# EAGLE design SOC_1_0 (EAGLE 8.3.2)
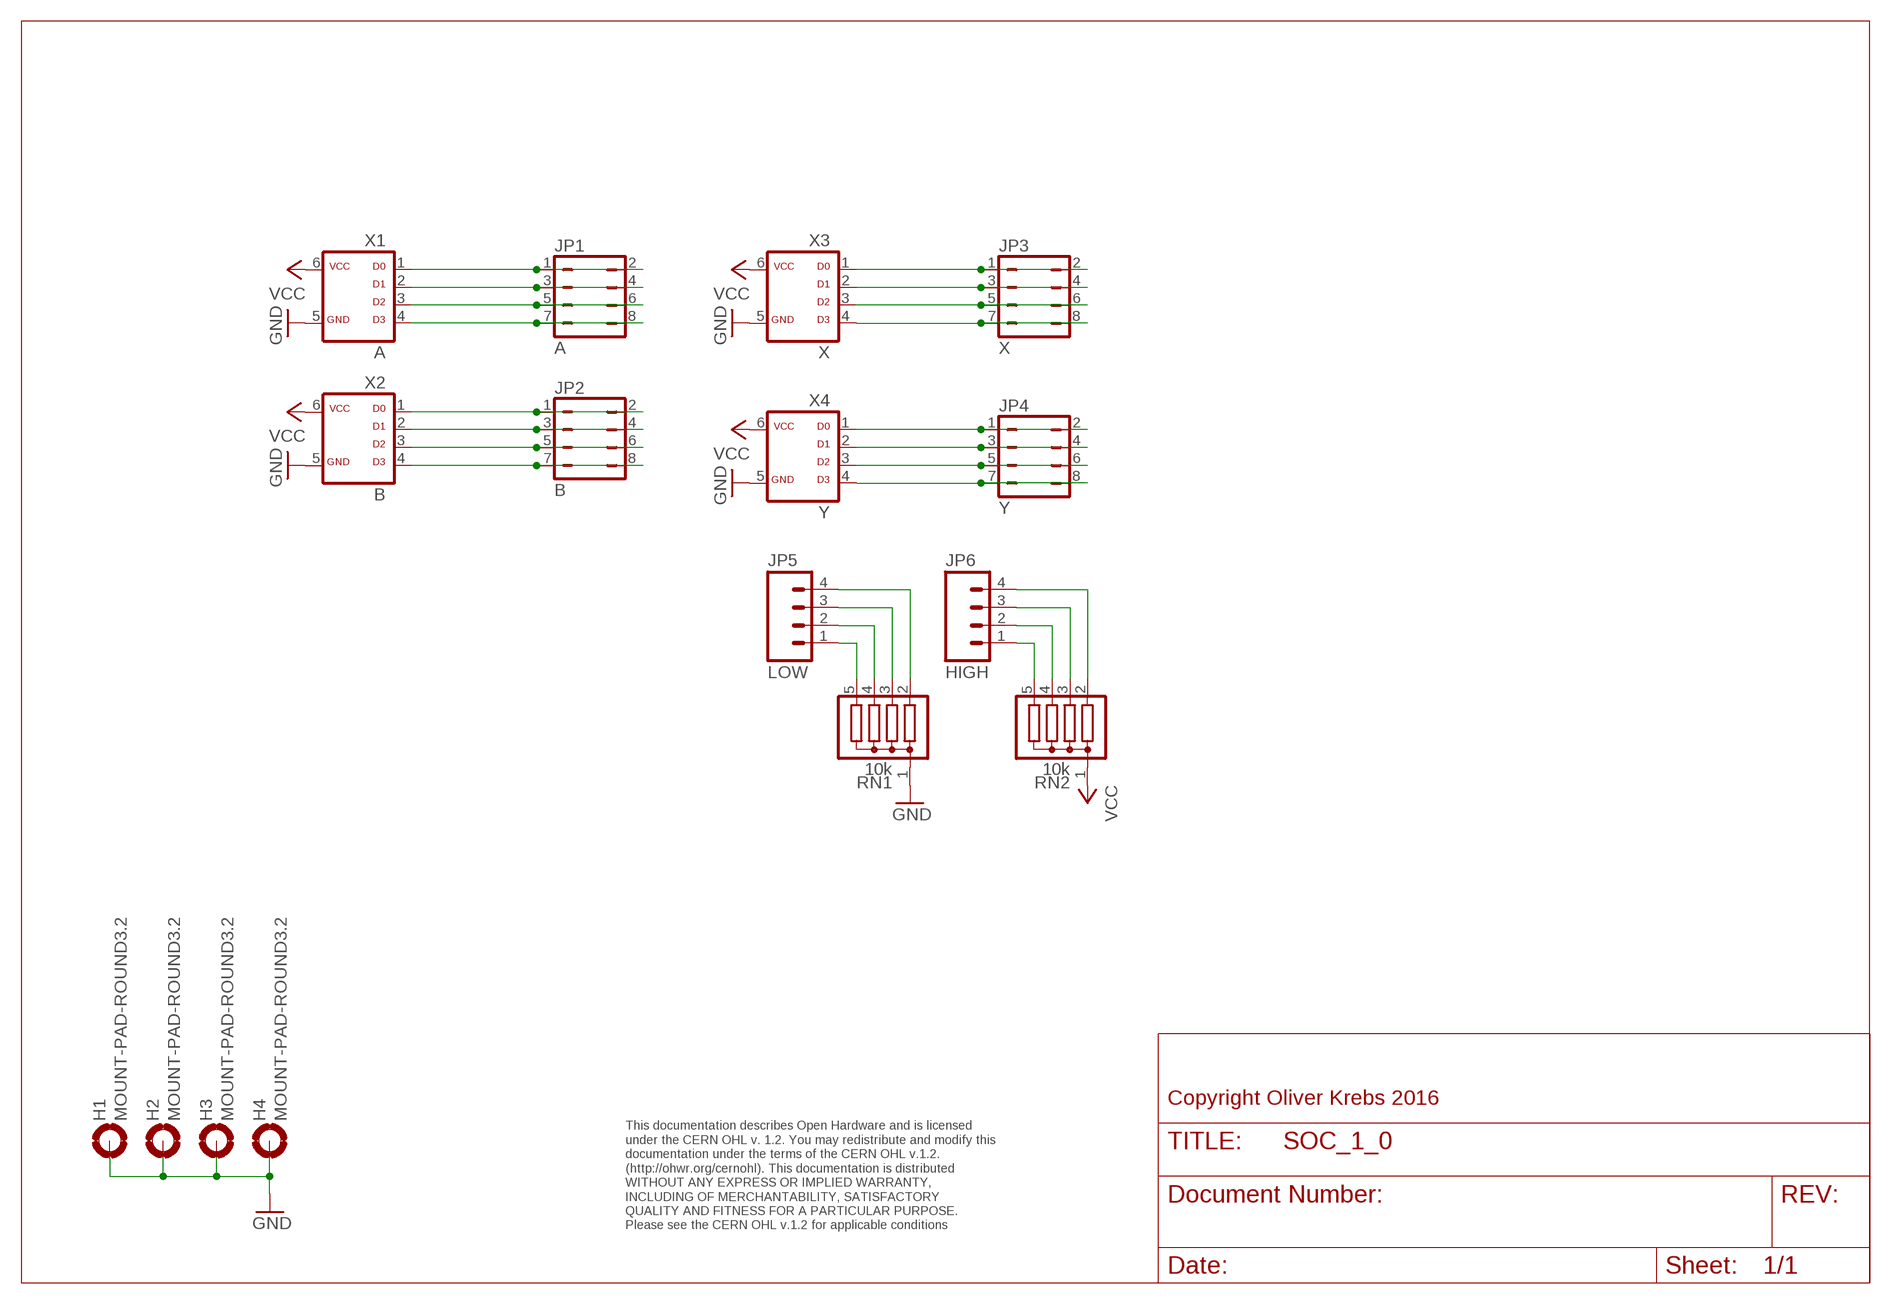
[diagram p0: schematic, sheet 1]

## Parts
H1  MOUNT-PAD-ROUND3.2  [3,2-PAD]
H2  MOUNT-PAD-ROUND3.2  [3,2-PAD]
H3  MOUNT-PAD-ROUND3.2  [3,2-PAD]
H4  MOUNT-PAD-ROUND3.2  [3,2-PAD]
JP1  A  JP4Q  [JP4Q]
JP2  B  JP4Q  [JP4Q]
JP3  X  JP4Q  [JP4Q]
JP4  Y  JP4Q  [JP4Q]
JP5  LOW  M04PTH  [1X04]
JP6  HIGH  M04PTH  [1X04]
RN1  10k  G04R  [SIL5]
RN2  10k  G04R  [SIL5]
X1  A  ML6D  [ML-6]
X2  B  ML6D  [ML-6]
X3  X  ML6D  [ML-6]
X4  Y  ML6D  [ML-6]

## Nets
GND: H1.B3,2(MOUNT) H2.B3,2(MOUNT) H3.B3,2(MOUNT) H4.B3,2(MOUNT) RN1.1 X1.5 X2.5 X3.5 X4.5
N$1: JP2.1 JP2.2 X2.1
N$2: JP2.3 JP2.4 X2.2
N$3: JP2.5 JP2.6 X2.3
N$4: JP2.7 JP2.8 X2.4
N$5: JP4.1 JP4.2 X4.1
N$6: JP4.3 JP4.4 X4.2
N$7: JP4.5 JP4.6 X4.3
N$8: JP4.7 JP4.8 X4.4
N$9: JP1.1 JP1.2 X1.1
N$10: JP1.3 JP1.4 X1.2
N$11: JP1.5 JP1.6 X1.3
N$12: JP1.7 JP1.8 X1.4
N$13: JP3.1 JP3.2 X3.1
N$14: JP3.3 JP3.4 X3.2
N$15: JP3.5 JP3.6 X3.3
N$16: JP3.7 JP3.8 X3.4
N$17: JP5.2 RN1.4
N$18: JP5.3 RN1.3
N$19: JP5.1 RN1.5
N$22: JP5.4 RN1.2
N$23: JP6.1 RN2.5
N$24: JP6.2 RN2.4
N$25: JP6.3 RN2.3
N$26: JP6.4 RN2.2
VCC: RN2.1 X1.6 X2.6 X3.6 X4.6

## Notes on the sheet
- Copyright Oliver Krebs 2016
- This documentation describes Open Hardware and is licensed 
  under the CERN OHL v. 1.2. You may redistribute and modify this 
  documentation under the terms of the CERN OHL v.1.2. 
  (http://ohwr.org/cernohl). This documentation is distributed
  WITHOUT ANY EXPRESS OR IMPLIED WARRANTY, 
  INCLUDING OF MERCHANTABILITY, SATISFACTORY 
  QUALITY AND FITNESS FOR A PARTICULAR PURPOSE. 
  Please see the CERN OHL v.1.2 for applicable conditions

## Library data of the parts
H1-H4 = holes:MOUNT-PAD-ROUND: MOUNTING PAD, round
JP1-JP4 = 01-my-jumper:JP4Q: JUMPER
JP5 JP6 = SparkFun-Connectors:M04: Header 4 Standard 4-pin 0.1" header. Use with straight break away headers (SKU : PRT-00116), right angle break away headers (PRT-00553), swiss pins (PRT-00743), machine pins (PRT-00117), and female headers (PRT-00115). Molex polarized connector foot print use with SKU : PRT-08231 with associated crimp pins and housings. 1MM SMD Version SKU: PRT-10208
RN1 RN2 = resistor-sil:G04R: SIL RESISTOR; OC_FARNELL: unknown; OC_NEWARK: unknown
X1-X4 = 01-my-con:ML6D

## Board
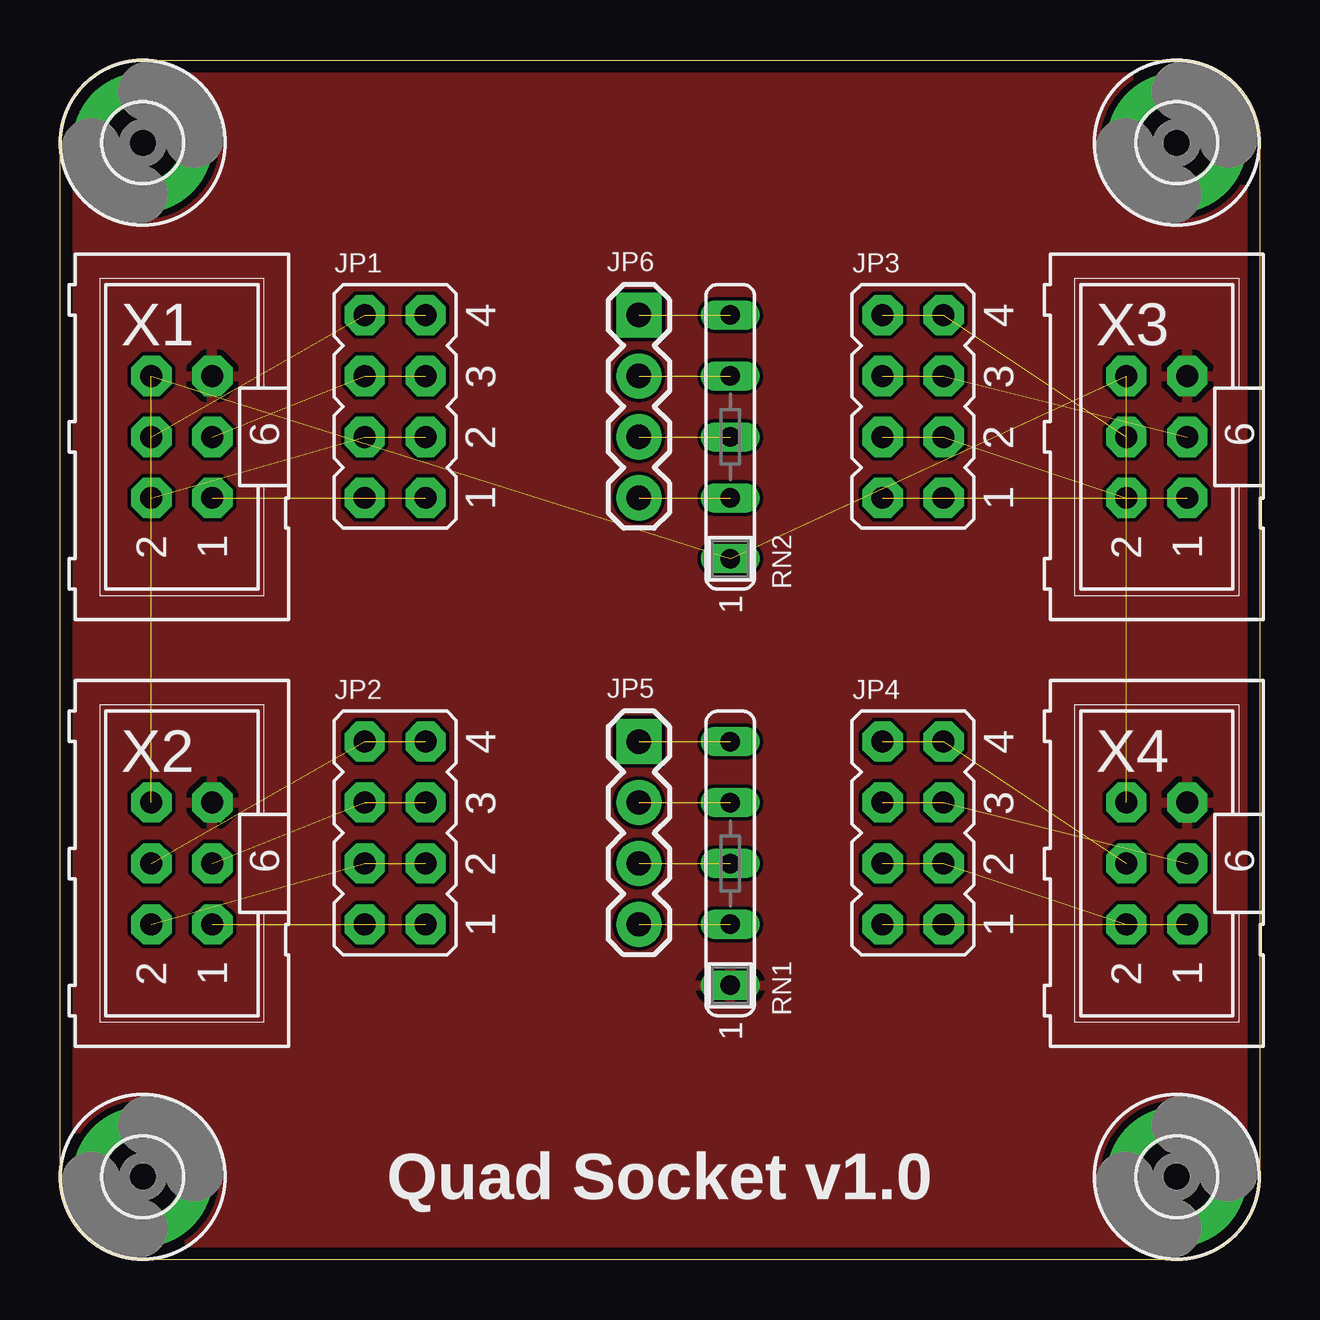
[diagram p1: board, top side]
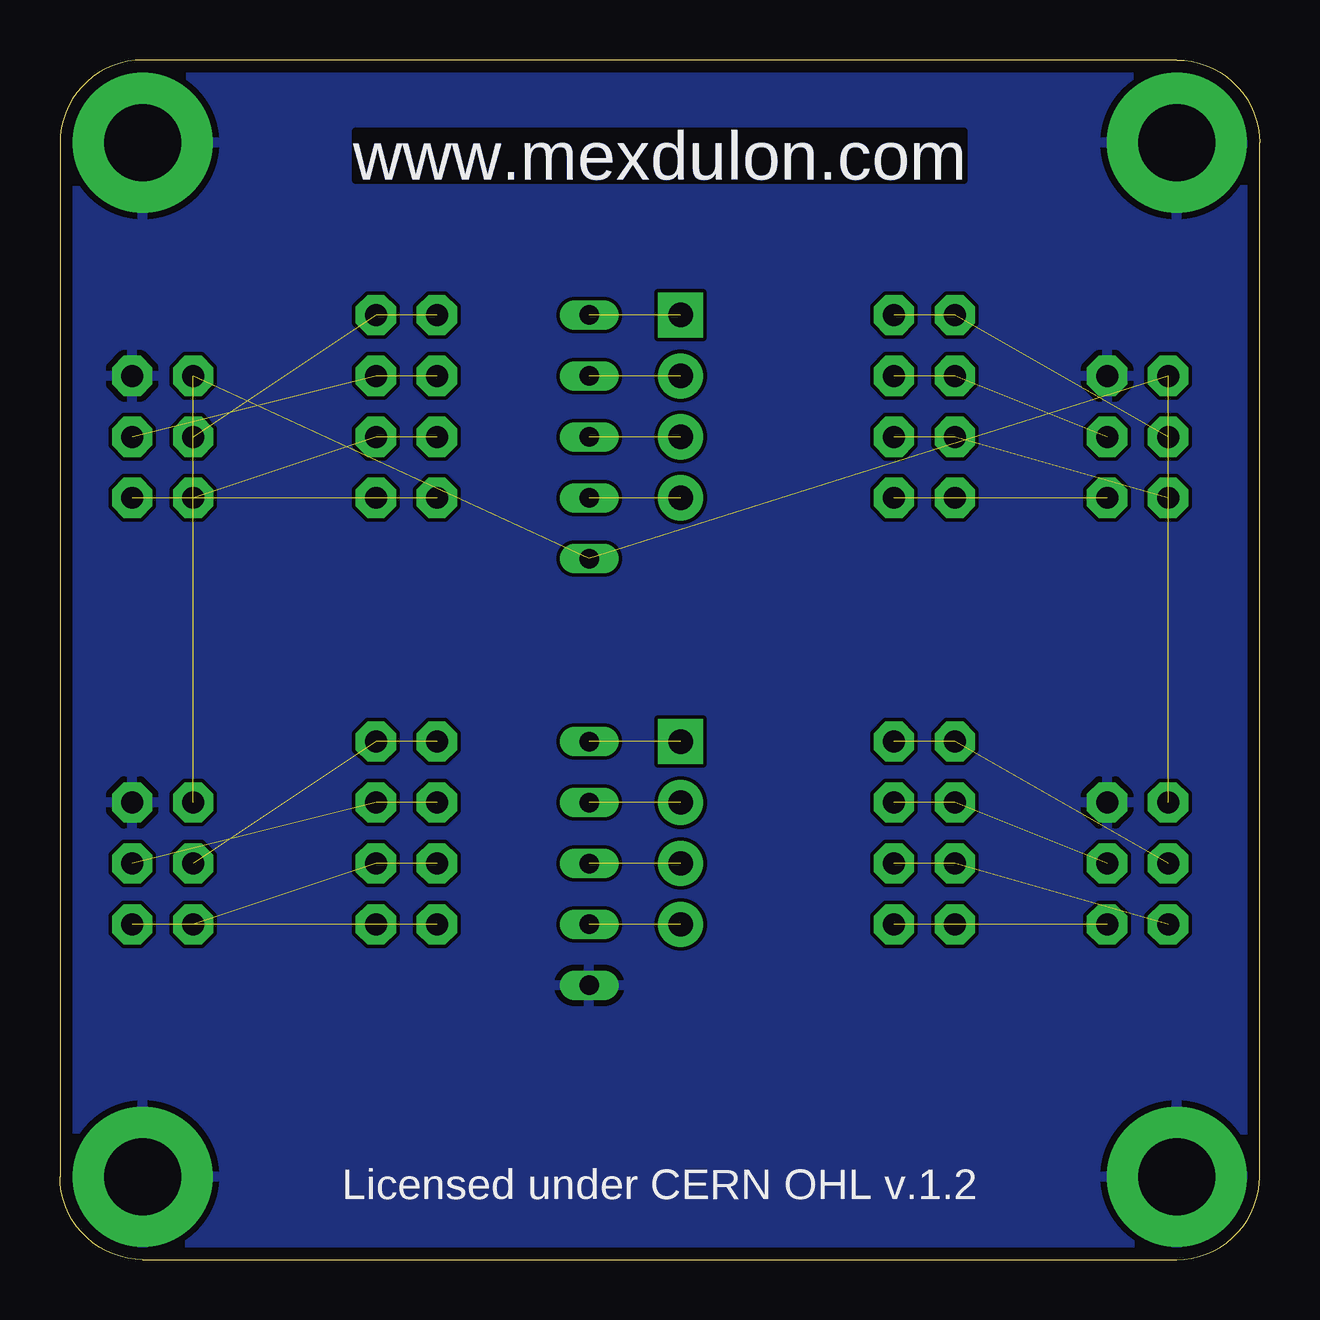
[diagram p2: board, bottom side, seen from below]

Size 50 x 50 mm. Coordinates in mm from the lower left corner, seen from the top.
Outline: 0,3.45 0,46.55 arc-90 3.45,50 46.55,50 arc-90 50,46.55 50,3.45 arc-90 46.55,0 3.45,0 arc-90 0,3.45
Copper layers (1*16): Top 0.035mm / dielectric 1.6mm / Bottom 0.035mm
Design rules "Elecrow_2-layer_PCB_eagle_rule": minimum track width 6mil, minimum drill 12mil, track to track 6mil, track to pad 6mil, pad to pad 6mil, via to via 8mil, smd to smd 0mil, copper to edge 20mil, drill to drill 10mil, minimum pad ring 6mil, minimum via ring 6mil, stop-mask expansion 0mil, vias tented up to drill 100mil, thermal gap 10mil

### Footprints (pad centres in the part's own frame; a part is rotated, then mirrored left to right if it is on the bottom)
3,2-PAD = drill 3.2 pad 5.842: B3,2 0,0
JP4Q = drill 0.914 pad 1.676 octagon: 1 -3.81,-1.27; 2 -3.81,1.27; 3 -1.27,-1.27; 4 -1.27,1.27; 5 1.27,-1.27; 6 1.27,1.27; 7 3.81,-1.27; 8 3.81,1.27
1X04 = drill 1.016 pad 1.88 square: 1 0,0 | drill 1.016 pad 1.88: 2 2.54,0; 3 5.08,0; 4 7.62,0
SIL5 = drill 0.813 long: 1 -5.08,0; 2 -2.54,0; 3 0,0; 4 2.54,0; 5 5.08,0
ML-6 = drill 0.914 pad 1.676 octagon: 1 -2.54,-1.27; 2 -2.54,1.27; 3 0,-1.27; 4 0,1.27; 5 2.54,-1.27; 6 2.54,1.27

### Placement (x,y rotation side)
H1  3.45,3.45 0 top
H2  3.45,46.55 0 top
H3  46.55,3.45 0 top
H4  46.55,46.55 0 top
JP1  13.97,35.56 90 top
JP2  13.97,17.78 90 top
JP3  35.56,35.56 90 top
JP4  35.56,17.78 90 top
JP5  24.13,21.59 270 top
JP6  24.13,39.37 270 top
RN1  27.94,16.51 90 top
RN2  27.94,34.29 90 top
X1  5.08,34.29 90 top
X2  5.08,16.51 90 top
X3  45.72,34.29 90 top
X4  45.72,16.51 90 top

### Tracks (layer width: path | path; a pad name or v marks a point on that pad's centre or on a via)
GND
  pour Bottom: 0,0 50.8,0 50.8,50.8 0,50.8
  pour Top: 0,50.16 50.16,50.16 50.16,0 0,0
N$1  (2 unrouted)
N$2  (2 unrouted)
N$3  (2 unrouted)
N$4  (2 unrouted)
N$5  (2 unrouted)
N$6  (2 unrouted)
N$7  (2 unrouted)
N$8  (2 unrouted)
N$9  (2 unrouted)
N$10  (2 unrouted)
N$11  (2 unrouted)
N$12  (2 unrouted)
N$13  (2 unrouted)
N$14  (2 unrouted)
N$15  (2 unrouted)
N$16  (2 unrouted)
N$17  (1 unrouted)
N$18  (1 unrouted)
N$19  (1 unrouted)
N$22  (1 unrouted)
N$23  (1 unrouted)
N$24  (1 unrouted)
N$25  (1 unrouted)
N$26  (1 unrouted)
VCC  (4 unrouted)

### Text on the board
Bottom: www.mexdulon.com
tNames: Quad Socket v1.0
bNames: www.mexdulon.com | Licensed under CERN OHL v.1.2